# Altium schematic sheet DCMotorControl.SchDoc
size Letter; Organization: Altium Limited; Address1: L3, 12a Rodborough Rd; Address2: Frenchs Forest; Address3: NSW; Address4: Australia 2086; DocumentNumber: D_14; SheetNumber: 14; SheetTotal: 21
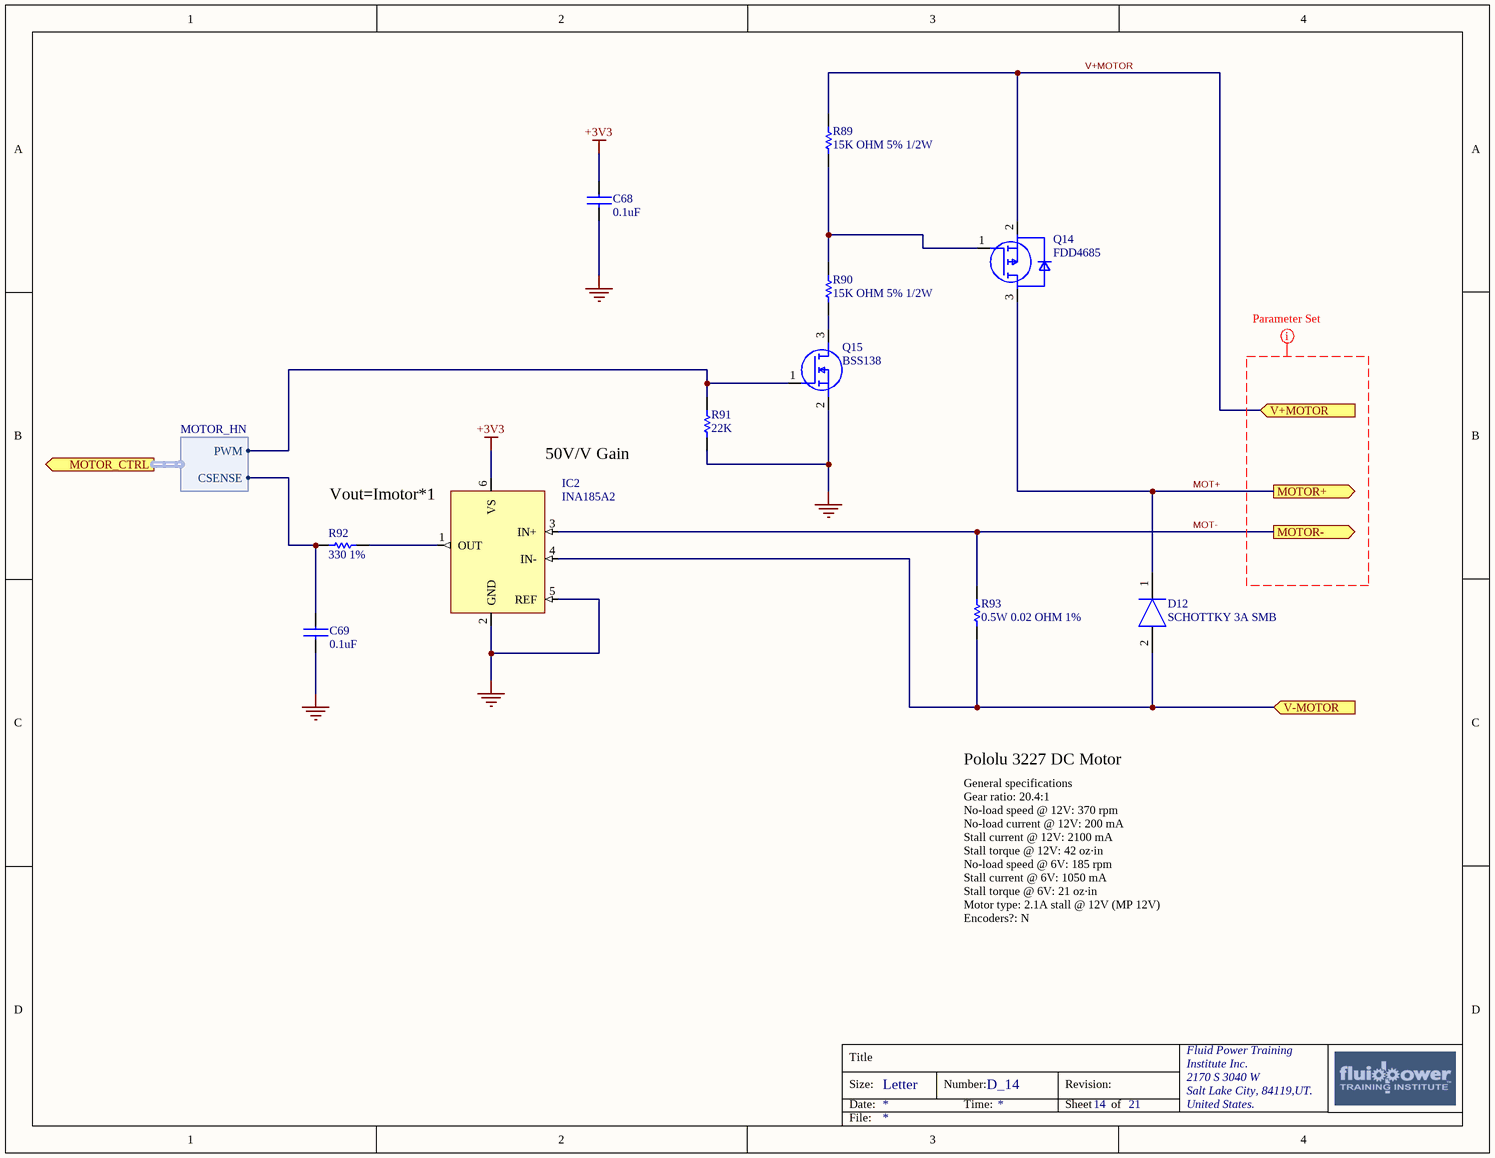
[diagram p0: DCMotorControl.SchDoc]

## Parts
C68  0.1uF  [C0805]
C69  0.1uF  [C0805]
D12  SCHOTTKY 3A SMB  [DIOM5436X265N]
IC2  INA185A2  [SOTFL50P160X60-6N]
Q14  FDD4685  [FFSD10120A]
Q15  BSS138  [SOT-23-3]
R89  15K OHM 5% 1/2W  [RESC3116X65X45NL15T20]
R90  15K OHM 5% 1/2W  [RESC3116X65X45NL15T20]
R91  22K  [R0805]
R92  330 1%  [R0805]
R93  0.5W 0.02 OHM 1%  [RESC3116X65X45NL15T20]

## Ports
MOTOR+ (out), MOTOR- (out), MOTOR_CTRL (out, harness MOTOR_HN), V+MOTOR (in), V-MOTOR (in)

## Harnesses
MOTOR_HN: PWM, CSENSE

## Nets
+3V3: C68.1 IC2.6(VS)
GND: C68.2 C69.2 IC2.2(GND) IC2.5(REF) Q15.2(S) R91.1
MOT+: D12.1(K) Q14.3(D) ; port MOTOR+
MOT-: IC2.3(IN+) R93.2 ; port MOTOR-
V+MOTOR: Q14.2(S) R89.2 ; port V+MOTOR
V-MOTOR: D12.2(A) IC2.4(IN-) R93.1 ; port V-MOTOR
NetC69_1: C69.1 R92.1 ; port MOTOR_CTRL.CSENSE
NetIC2_1: IC2.1(OUT) R92.2
NetQ14_1: Q14.1(G) R89.1 R90.2
NetQ15_1: Q15.1(G) R91.2 ; port MOTOR_CTRL.PWM
NetQ15_3: Q15.3(D) R90.1

## Layout directives
net class MOTORPOWER: (no net found under the mark)

## Notes on the sheet
- (near IC2) Vout=Imotor*1
- (near IC2) 50V/V Gain
- Pololu 3227 DC Motor
- General specifications
  Gear ratio:	20.4:1
  No-load speed @ 12V:	370 rpm
  No-load current @ 12V:	200 mA
  Stall current @ 12V:	2100 mA
  Stall torque @ 12V:	42 oz·in
  No-load speed @ 6V:	185 rpm
  Stall current @ 6V:	1050 mA
  Stall torque @ 6V:	21 oz·in
  Motor type:	2.1A stall @ 12V (MP 12V)
  Encoders?:	N
- Title
- Size:
- Date:
- Letter
- Number:
- Time:
- Revision:
- Sheet
- of
- Fluid Power Training
- Institute Inc.
- 2170 S 3040 W
- Salt Lake City, 84119,UT.
- United States.
- File:

## Library data of the parts
C68 C69 = C0805C104K5RACTU: Cap Ceramic 0.1uF 50V X7R 10% SMD 2.0 x 1.2 mm 125 C Paper T/R; Manufacturer: KEMET; Capacitance: 100nF; Voltage: 500V; Supplier 1: Mouser; Supplier Part Number 1: 80-C0805C104K5R; Manufacturer Part Number: C0805C104K5RACTU; RoHS: Yes; Category: Ceramic Capacitors; Stock 1: 4177670; Pricing 1: 1=0.17000, 10=0.10400, 100=0.05600, 500=0.03900, 1000=0.03200, 4000=0.02400 (USD); Mount: Surface Mount,PCB; Case/Package: 0805; Number of Pins: 2; Case Code (Imperial): 0805; Case Code (Metric): 2012; Dielectric Material: Ceramic; Contact Plating: Tin,Matte; Min Operating Temperature: -55°C; Max Operating Temperature: 125°C; Voltage Rating: 50V; Tolerance: 10%; Packaging: Tape and Reel; Dielectric: X7R; Package Quantity: 4000; Voltage Rating (DC): 50V; Termination: SMD/SMT; Length: 2mm; Height: 0.9mm; Width: 1.2mm; Depth: 1.25mm; Thickness: 0.035inch; Lead Pitch: 0.75mm; Radiation Hardening: No; REACH SVHC: No SVHC; ComponentLink1URL: https://datasheet.ciiva.com/14589/70095383-14589048.pdf?src-supplier=Allied+Electronics; ComponentLink1Description: https://datasheet.ciiva.com/14589/70095383-14589048.pdf?src-supplier=Allied+Electronics; ComponentLink2URL: https://datasheet.ciiva.com/28682/1851736-28682232.pdf?src-supplier=Element14; ComponentLink2Description: https://datasheet.ciiva.com/28682/1851736-28682232.pdf?src-supplier=Element14; ComponentLink3URL: https://datasheet.ciiva.com/32431/slceramic-chip-condensers-e-32431755.pdf?src-supplier=Distrelec; ComponentLink3Description: https://datasheet.ciiva.com/32431/slceramic-chip-condensers-e-32431755.pdf?src-supplier=Distrelec; ComponentLink4URL: https://datasheet.ciiva.com/18410/70095383-18410815.pdf?src-supplier=Allied+Electronics; ComponentLink4Description: https://datasheet.ciiva.com/18410/70095383-18410815.pdf?src-supplier=Allied+Electronics
D12 = STPS340UY: DIODE SCHOTTKY 40V 3A SMB; Manufacturer_Name: STMicroelectronics; Peak Reverse Current: 20uA; Peak Non-Repetitive Surge Current: 75A; Element Configuration: Single; Forward Voltage: 840mV; Max Reverse Leakage Current: 10mA; Datasheet Link: https://ms.componentsearchengine.com/Datasheets/2/STPS340UY.pdf; Height: 2.65mm; Manufacturer_Part_Number: STPS340UY; Supplier 1: Mouser; Supplier Part Number 1: 511-STPS340UY; Manufacturer: STMicroelectronics; Manufacturer Part Number: STPS340UY; RoHS: Yes; Category: Rectifier Diodes; Stock 1: 8864; Pricing 1: 1=0.76000, 10=0.62700, 100=0.40400, 1000=0.32400, 2500=0.27300, 10000=0.26300, 25000=0.25300, 50000=0.24900, 100000=0.24300 (USD); Mount: Surface Mount; Case/Package: SMB; Number of Pins: 2; Min Operating Temperature: -40°C; Max Operating Temperature: 150°C; Forward Current: 3A; Max Repetitive Reverse Voltage (Vrrm): 40V; Max Surge Current: 75A; Packaging: Tape and Reel; Package Quantity: 1; Average Rectified Current: 3A; Max Reverse Voltage (DC): 40V; Radiation Hardening: No; Lead Free: Lead Free; ComponentLink1URL: https://datasheet.ciiva.com/25949/cd00270569-25949389.pdf?src-supplier=Avnet+Europe; ComponentLink1Description: https://datasheet.ciiva.com/25949/cd00270569-25949389.pdf?src-supplier=Avnet+Europe; ComponentLink2URL: https://datasheet.ciiva.com/13083/cd00270569-13083318.pdf?src-supplier=Mouser; ComponentLink2Description: https://datasheet.ciiva.com/13083/cd00270569-13083318.pdf?src-supplier=Mouser; ComponentLink3URL: https://datasheet.ciiva.com/6381/cd00270569-6381594.pdf?src-supplier=Digi-Key; ComponentLink3Description: https://datasheet.ciiva.com/6381/cd00270569-6381594.pdf?src-supplier=Digi-Key; ComponentLink4URL: https://datasheet.ciiva.com/6381/cd00270569-6381595.pdf?src-supplier=Digi-Key; ComponentLink4Description: https://datasheet.ciiva.com/6381/cd00270569-6381595.pdf?src-supplier=Digi-Key; ComponentLink5URL: https://datasheet.ciiva.com/6381/cd00270569-6381596.pdf?src-supplier=Digi-Key; ComponentLink5Description: https://datasheet.ciiva.com/6381/cd00270569-6381596.pdf?src-supplier=Digi-Key
IC2 = INA185A2IDRLR: Current Sense Amplifiers A 595-INA185A2IDRLT; Manufacturer: Texas Instruments; Supplier 1: Mouser; Manufacturer Part Number: INA185A2IDRLR; RoHS: No; Stock 1: 5511; Pricing 1: 1=1.68000, 10=1.43000, 100=1.14000, 500=1.00000, 1000=0.82900, 4000=0.74300, 8000=0.71500 (USD); Supplier Part Number 1: 595-INA185A2IDRLR
Q14 = FDD4685: Trans MOSFET P-CH 40V 8.4A 3-Pin(2+Tab) DPAK T/R; Manufacturer: ON Semiconductor / Fairchild; Rise Time: 15ns; Fall Time: 14ns; Turn-Off Delay Time: 34ns; Gate to Source Voltage (Vgs): 20V; Rds On Max: 27mR; Input Capacitance: 2.38nF; Max Power Dissipation: 69W; Turn-On Delay Time: 8ns; Drain to Source Breakdown Voltage: -40V; Number of Elements: 1; Element Configuration: Single; Nominal Vgs: -1.6V; Current Rating: -8.4A; Supplier 1: Mouser; Manufacturer Part Number: FDD4685; RoHS: Yes; Category: Integrated Circuits (ICs); Stock 1: 9242; Pricing 1: 1=1.02000, 10=0.87500, 100=0.67200, 500=0.59400, 1000=0.46900, 2500=0.44700 (USD); Mount: Surface Mount; Case/Package: TO-252; Number of Pins: 3; Weight: 0.26037g; Contact Plating: Tin,Matte; Min Operating Temperature: -55°C; Max Operating Temperature: 150°C; Continuous Drain Current (ID): 8.4A; Package Quantity: 2500; Packaging: Tape and Reel; Drain to Source Voltage (Vdss): 40V; Power Dissipation: 69W; Drain to Source Resistance: 27mR; Threshold Voltage: -1.6V; Voltage Rating (DC): -40V; Dual Supply Voltage: -40V; Termination: SMD/SMT; On-State Resistance: 27MR; Length: 6.73mm; Height: 2.39mm; Width: 6.22mm; Radiation Hardening: No; Lead Free: Lead Free; REACH SVHC: No SVHC; ComponentLink1URL: https://datasheet.ciiva.com/6382/fdd4685-6382336.pdf?src-supplier=Digi-Key; ComponentLink1Description: https://datasheet.ciiva.com/6382/fdd4685-6382336.pdf?src-supplier=Digi-Key; ComponentLink2URL: https://datasheet.ciiva.com/22700/298848-22700881.pdf?src-supplier=Element14; ComponentLink2Description: https://datasheet.ciiva.com/22700/298848-22700881.pdf?src-supplier=Element14; ComponentLink3URL: https://datasheet.ciiva.com/4439/fdd4685-94891-4439978.pdf?src-supplier=Mouser; ComponentLink3Description: https://datasheet.ciiva.com/4439/fdd4685-94891-4439978.pdf?src-supplier=Mouser; ComponentLink4URL: https://datasheet.ciiva.com/16742/fdd4685-16742918.pdf?src-supplier=Future+Electronics; ComponentLink4Description: https://datasheet.ciiva.com/16742/fdd4685-16742918.pdf?src-supplier=Future+Electronics; ComponentLink5URL: https://datasheet.ciiva.com/7967/298848-7967879.pdf?src-supplier=Element14; ComponentLink5Description: https://datasheet.ciiva.com/7967/298848-7967879.pdf?src-supplier=Element14; ComponentLink6URL: https://datasheet.ciiva.com/26144/fdd4685-26144727.pdf?src-supplier=Avnet+Europe; ComponentLink6Description: https://datasheet.ciiva.com/26144/fdd4685-26144727.pdf?src-supplier=Avnet+Europe; ComponentLink7URL: https://datasheet.ciiva.com/22746/1930081-22746458.pdf?src-supplier=Element14; ComponentLink7Description: https://datasheet.ciiva.com/22746/1930081-22746458.pdf?src-supplier=Element14; ComponentLink8URL: https://datasheet.ciiva.com/11175/fdd4685-11175308.pdf?src-supplier=Avnet; ComponentLink8Description: https://datasheet.ciiva.com/11175/fdd4685-11175308.pdf?src-supplier=Avnet; ComponentLink9URL: https://datasheet.ciiva.com/22655/1930081-22655292.pdf?src-supplier=Element14; ComponentLink9Description: https://datasheet.ciiva.com/22655/1930081-22655292.pdf?src-supplier=Element14; Supplier Part Number 1: 512-FDD4685
Q15 = BSS138: MOSFET N-CH 50V 220MA SOT-23; Manufacturer: ON Semiconductor / Fairchild; Element Configuration: Single; Rds On Max: 3.5R; Input Capacitance: 27pF; Max Power Dissipation: 360mW; Rise Time: 9ns; Turn-Off Delay Time: 20ns; Gate to Source Voltage (Vgs): 20V; Turn-On Delay Time: 2.5ns; Number of Elements: 1; Threshold Voltage: 1.3V; On-State Resistance: 6R; Supplier 1: Mouser; Manufacturer Part Number: BSS138; RoHS: Yes; Category: MOSFETs; Stock 1: 736044; Pricing 1: 1=0.26000, 10=0.17800, 100=0.07400, 1000=0.05000, 3000=0.03900, 9000=0.03300, 24000=0.03100, 45000=0.02900 (USD); Mount: Surface Mount; Case/Package: SOT-23; Number of Pins: 3; Weight: 0.03g; Contact Plating: Tin,Matte; Min Operating Temperature: -55°C; Max Operating Temperature: 150°C; Packaging: Tape and Reel; Continuous Drain Current (ID): 220mA; Drain to Source Voltage (Vdss): 50V; Drain to Source Breakdown Voltage: 50V; Fall Time: 9ns; Drain to Source Resistance: 3.5R; Package Quantity: 1; Power Dissipation: 360mW; Voltage Rating (DC): 50V; Current Rating: 220mA; Nominal Vgs: 1.3V; Dual Supply Voltage: 50V; Termination: SMD/SMT; Length: 2.92mm; Height: 0.93mm; Width: 1.3mm; Radiation Hardening: No; Lead Free: Lead Free; REACH SVHC: No SVHC; ComponentLink1URL: https://datasheet.ciiva.com/931/bss138-931776.pdf?src-supplier=Digi-Key; ComponentLink1Description: https://datasheet.ciiva.com/931/bss138-931776.pdf?src-supplier=Digi-Key; ComponentLink2URL: https://datasheet.ciiva.com/1190/193736-1190130.pdf?src-supplier=Element14; ComponentLink2Description: https://datasheet.ciiva.com/1190/193736-1190130.pdf?src-supplier=Element14; ComponentLink3URL: https://datasheet.ciiva.com/27050/784896-27050043.pdf?src-supplier=Jameco; ComponentLink3Description: https://datasheet.ciiva.com/27050/784896-27050043.pdf?src-supplier=Jameco; ComponentLink4URL: https://datasheet.ciiva.com/1190/193736-1190131.pdf?src-supplier=Element14; ComponentLink4Description: https://datasheet.ciiva.com/1190/193736-1190131.pdf?src-supplier=Element14; ComponentLink5URL: https://datasheet.ciiva.com/1254/193736-1254983.pdf?src-supplier=Newark; ComponentLink5Description: https://datasheet.ciiva.com/1254/193736-1254983.pdf?src-supplier=Newark; ComponentLink6URL: https://datasheet.ciiva.com/16834/bss138-16834843.pdf?src-supplier=Future+Electronics; ComponentLink6Description: https://datasheet.ciiva.com/16834/bss138-16834843.pdf?src-supplier=Future+Electronics; ComponentLink7URL: https://datasheet.ciiva.com/26229/bss138-26229007.pdf?src-supplier=Avnet+Europe; ComponentLink7Description: https://datasheet.ciiva.com/26229/bss138-26229007.pdf?src-supplier=Avnet+Europe; ComponentLink8URL: https://datasheet.ciiva.com/3304/bss138-3304424.pdf?src-supplier=Avnet; ComponentLink8Description: https://datasheet.ciiva.com/3304/bss138-3304424.pdf?src-supplier=Avnet; ComponentLink9URL: https://datasheet.ciiva.com/22655/193736-22655240.pdf?src-supplier=Element14; ComponentLink9Description: https://datasheet.ciiva.com/22655/193736-22655240.pdf?src-supplier=Element14; Supplier Part Number 1: 512-BSS138
R89 R90 = ESR18EZPJ153: RES SMD 15K OHM 5% 1/2W 1206; Manufacturer: Rohm; Resistance: 6.2kR; Max Power Dissipation: 500mW; Temperature Coefficient: 200ppm/°C; Supplier 1: Mouser; Manufacturer Part Number: ESR18EZPJ153; RoHS: Yes; Category: Chip SMD Resistors; Stock 1: 9337; Pricing 1: 1=0.16000, 10=0.14200, 100=0.05000, 1000=0.03400, 5000=0.02600, 10000=0.02200 (USD); Case/Package: 1206; Case Code (Imperial): 1206; Case Code (Metric): 3216; Min Operating Temperature: -55°C; Max Operating Temperature: 155°C; Composition: Thick Film; Features: Automotive AEC-Q200; Packaging: Tape and Reel; Tolerance: 5%; Number of Terminations: 2; ComponentLink1URL: https://www.rohm.com/datasheet/ESR01MZPF/esr-e?src-supplier=Digi-Key; ComponentLink1Description: https://www.rohm.com/datasheet/ESR01MZPF/esr-e?src-supplier=Digi-Key; Supplier Part Number 1: 755-ESR18EZPJ153
R91 = ERJ6ENF2202V: PANASONIC - ERJ6ENF2202V - SMD Chip Resistor, 0805 [2012 Metric], 22 kohm, ERJ6EN Series, 150 V, Thick Film, 125 mW; Resistance: 22kR; Tolerance: 1%; Temperature Coefficient: 100ppm/°C; Power Rating: 125mW; Voltage Rating: 150V; Supplier 1: Mouser; Supplier Part Number 1: 667-ERJ-6ENF2202V; Manufacturer: Panasonic; Manufacturer Part Number: ERJ6ENF2202V; RoHS: Yes; Category: Chip SMD Resistors; Stock 1: 57430; Pricing 1: 1=0.10000, 10=0.08300, 100=0.03200, 1000=0.01800, 5000=0.01800, 10000=0.01800 (USD); Mount: Surface Mount; Case/Package: 0805; Number of Pins: 2; Case Code (Imperial): 0805; Case Code (Metric): 2012; Contact Plating: Tin; Min Operating Temperature: -55°C; Max Operating Temperature: 155°C; Packaging: Tape and Reel; Composition: Thick Film; Number of Terminations: 2; Max Power Dissipation: 125mW; Termination: SMD/SMT; Package Quantity: 1; Voltage Rating (DC): 150V; Features: Automotive AEC-Q200; Military Standard: Not; Length: 2mm; Height: 0.6mm; Width: 1.2mm; Depth: 1.25mm; Radiation Hardening: No; Lead Free: Lead Free; REACH SVHC: No SVHC; ComponentLink1URL: https://datasheet.ciiva.com/11821/0900766b80f80784-11821559.pdf?src-supplier=RSComponents; ComponentLink1Description: https://datasheet.ciiva.com/11821/0900766b80f80784-11821559.pdf?src-supplier=RSComponents; ComponentLink2URL: https://datasheet.ciiva.com/24070/aoa0000ce2-24070245.pdf?src-supplier=Mouser; ComponentLink2Description: https://datasheet.ciiva.com/24070/aoa0000ce2-24070245.pdf?src-supplier=Mouser; ComponentLink3URL: https://datasheet.ciiva.com/30139/aoa0000ce2-30139797.pdf?src-supplier=Onlinecomponents.com; ComponentLink3Description: https://datasheet.ciiva.com/30139/aoa0000ce2-30139797.pdf?src-supplier=Onlinecomponents.com; ComponentLink4URL: https://datasheet.ciiva.com/7802/426256-7802439.pdf?src-supplier=Element14; ComponentLink4Description: https://datasheet.ciiva.com/7802/426256-7802439.pdf?src-supplier=Element14; ComponentLink5URL: https://datasheet.ciiva.com/22687/1678782-22687079.pdf?src-supplier=Element14; ComponentLink5Description: https://datasheet.ciiva.com/22687/1678782-22687079.pdf?src-supplier=Element14; ComponentLink6URL: https://datasheet.ciiva.com/16787/70260748-16787961.pdf?src-supplier=Allied+Electronics; ComponentLink6Description: https://datasheet.ciiva.com/16787/70260748-16787961.pdf?src-supplier=Allied+Electronics; ComponentLink7URL: https://datasheet.ciiva.com/17210/aoa0000ce2-17210956.pdf?src-supplier=Avnet+Europe; ComponentLink7Description: https://datasheet.ciiva.com/17210/aoa0000ce2-17210956.pdf?src-supplier=Avnet+Europe; ComponentLink8URL: https://datasheet.ciiva.com/22668/1678782-22668332.pdf?src-supplier=Element14; ComponentLink8Description: https://datasheet.ciiva.com/22668/1678782-22668332.pdf?src-supplier=Element14; ComponentLink9URL: https://datasheet.ciiva.com/6138/426256-6138190.pdf?src-supplier=Farnell; ComponentLink9Description: https://datasheet.ciiva.com/6138/426256-6138190.pdf?src-supplier=Farnell; ComponentLink10URL: https://datasheet.ciiva.com/46419/1678782-46419998.pdf?src-supplier=Element14; ComponentLink10Description: https://datasheet.ciiva.com/46419/1678782-46419998.pdf?src-supplier=Element14
R92 = ERJ-6ENF3300V: RES SMD 330 OHM 1% 1/8W 0805; Manufacturer: Panasonic; Resistance: 330R; Power Rating: 125mW; Temperature Coefficient: 100ppm/°C; Voltage Rating: 150V; Supplier 1: Mouser; Supplier Part Number 1: 667-ERJ-6ENF3300V; Manufacturer Part Number: ERJ-6ENF3300V; RoHS: Yes; Category: Chip SMD Resistors; Stock 1: 121287; Pricing 1: 1=0.10000, 10=0.08900, 100=0.03500, 500=0.03500, 1000=0.01900, 5000=0.01700 (USD); Mount: Surface Mount; Case/Package: 0805; Number of Pins: 2; Case Code (Imperial): 0805; Case Code (Metric): 2012; Contact Plating: Tin; Min Operating Temperature: -55°C; Max Operating Temperature: 155°C; Packaging: Tape and Reel; Tolerance: 1%; Composition: Thick Film; Termination: SMD/SMT; Number of Terminations: 2; Max Power Dissipation: 125mW; Package Quantity: 1; Military Standard: Not; Features: Automotive AEC-Q200; Length: 2mm; Height: 0.6mm; Width: 1.2mm; Depth: 1.25mm; Radiation Hardening: No; REACH SVHC: No SVHC; ComponentLink1URL: https://datasheet.ciiva.com/11821/0900766b80f80784-11821635.pdf?src-supplier=RSComponents; ComponentLink1Description: https://datasheet.ciiva.com/11821/0900766b80f80784-11821635.pdf?src-supplier=RSComponents; ComponentLink2URL: https://datasheet.ciiva.com/30131/aoa0000ce2-30131349.pdf?src-supplier=Onlinecomponents.com; ComponentLink2Description: https://datasheet.ciiva.com/30131/aoa0000ce2-30131349.pdf?src-supplier=Onlinecomponents.com; ComponentLink3URL: https://datasheet.ciiva.com/24025/aoa0000ce2-24025991.pdf?src-supplier=Mouser; ComponentLink3Description: https://datasheet.ciiva.com/24025/aoa0000ce2-24025991.pdf?src-supplier=Mouser; ComponentLink4URL: https://datasheet.ciiva.com/17206/aoa0000ce2-17206152.pdf?src-supplier=Avnet+Europe; ComponentLink4Description: https://datasheet.ciiva.com/17206/aoa0000ce2-17206152.pdf?src-supplier=Avnet+Europe; ComponentLink5URL: https://datasheet.ciiva.com/46436/1678782-46436633.pdf?src-supplier=Element14; ComponentLink5Description: https://datasheet.ciiva.com/46436/1678782-46436633.pdf?src-supplier=Element14; ComponentLink6URL: https://datasheet.ciiva.com/46436/1678782-46436634.pdf?src-supplier=Element14; ComponentLink6Description: https://datasheet.ciiva.com/46436/1678782-46436634.pdf?src-supplier=Element14; ComponentLink7URL: https://datasheet.ciiva.com/16760/70260748-16760668.pdf?src-supplier=Allied+Electronics; ComponentLink7Description: https://datasheet.ciiva.com/16760/70260748-16760668.pdf?src-supplier=Allied+Electronics; ComponentLink8URL: https://datasheet.ciiva.com/16780/70260748-16780764.pdf?src-supplier=Allied+Electronics; ComponentLink8Description: https://datasheet.ciiva.com/16780/70260748-16780764.pdf?src-supplier=Allied+Electronics; ComponentLink9URL: https://datasheet.ciiva.com/22684/1678782-22684798.pdf?src-supplier=Element14; ComponentLink9Description: https://datasheet.ciiva.com/22684/1678782-22684798.pdf?src-supplier=Element14; ComponentLink10URL: https://datasheet.ciiva.com/28590/1678782-28590783.pdf?src-supplier=Element14; ComponentLink10Description: https://datasheet.ciiva.com/28590/1678782-28590783.pdf?src-supplier=Element14
R93 = L4T12FR020FER: Current Sense Resistors - SMD 0.5W 0.02 OHM 1%; Manufacturer: Ohmite; Manufacturer Part Number: L4T12FR020FER; RoHS: No; Stock 1: 4995; Pricing 1: 1=0.170000, 10=0.166000, 25=0.146000, 50=0.133000, 100=0.115000, 250=0.100000, 500=0.083000, 1000=0.068000, 5000=0.064000 (USD); Supplier 1: Mouser; Supplier Part Number 1: 284-L4T12FR020FER